# EAGLE schematic untitled (EAGLE 5.11)
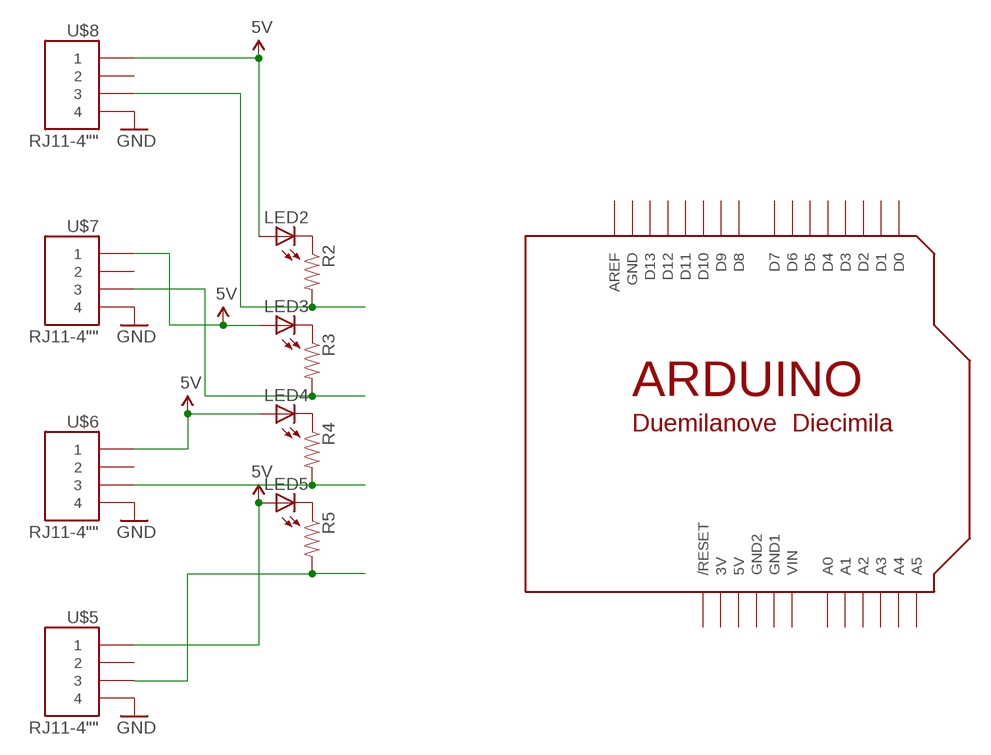
[diagram p0: schematic, sheet 1]

## Parts
LED2  LED3MM  [LED3MM]
LED3  LED3MM  [LED3MM]
LED4  LED3MM  [LED3MM]
LED5  LEDFATPAD  [LED3MM-W]
R2  RESISTOR  [0805]
R3  RESISTOR  [0805]
R4  RESISTOR  [0805]
R5  RESISTOR  [0805]
U$5  RJ11-4""  [RJ11-4]
U$6  RJ11-4""  [RJ11-4]
U$7  RJ11-4""  [RJ11-4]
U$8  RJ11-4""  [RJ11-4]
U$9  ARDUINO-NOHOLE  [ARDUINO-NOHOLE]

## Nets
GND: U$5.4 U$6.4 U$7.4 U$8.4
N$2: R2.2 U$8.3
N$3: R3.2 U$7.3
N$4: R4.2 U$6.3
N$5: R5.2 U$5.3
N$6: LED2.K(C) R2.1
N$7: LED3.K(C) R3.1
N$8: LED4.K(C) R4.1
N$9: LED5.K(C) R5.1
VCC: LED2.A LED3.A LED4.A LED5.A U$5.1 U$6.1 U$7.1 U$8.1 ; supply symbol labelled 5V
Unconnected: U$5.2 U$6.2 U$7.2 U$8.2 U$9.A0 U$9.A1 U$9.A2 U$9.A3 U$9.A4 U$9.A5 U$9.AREF U$9.D0 U$9.D1 U$9.D2 U$9.D3 U$9.D4 U$9.D5 U$9.D6 U$9.D7 U$9.D8 U$9.D9 U$9.D10 U$9.D11 U$9.D12 U$9.D13 U$9.RESET(/RESET)

## Power pins joined to a net without a drawn wire
3V: U$9.3V
GND: U$9.GND
GND1: U$9.GND1
GND2: U$9.GND2
VCC: U$9.5V
VIN: U$9.VIN

## Library data of the parts
LED2-LED5 = SparkFun:LED: LEDs Standard schematic elements and footprints for 5mm, 3mm, 1206, and 0603 sized LEDs. 5mm - Spark Fun Electronics SKU : COM-00529 (and others)
R2-R5 = SparkFun:RESISTOR: Resistor Basic schematic elements and footprints for 0603, 1206, and PTH 1/10th watt (small) resistors.
U$5-U$8 = 3d:RJ11-4
U$9 = adafruit:ARDUINO: Arduino Diecimila/Duemilanove Make a shield with ease, this package has all the named pins as well as the two mounting drill holes and an outline of the USB and DC power connector. The outline is on the DIMENSION layer, so if your board house uses it they will cut the outline to match. http://www.ladyada.net/library/pcb/eaglelibrary.html